# Altium schematic sheet LiPo_Charger.SchDoc: LiPo Charger
size 431 x 279 mm; Revision: 1.0; SheetNumber: 1; SheetTotal: 1
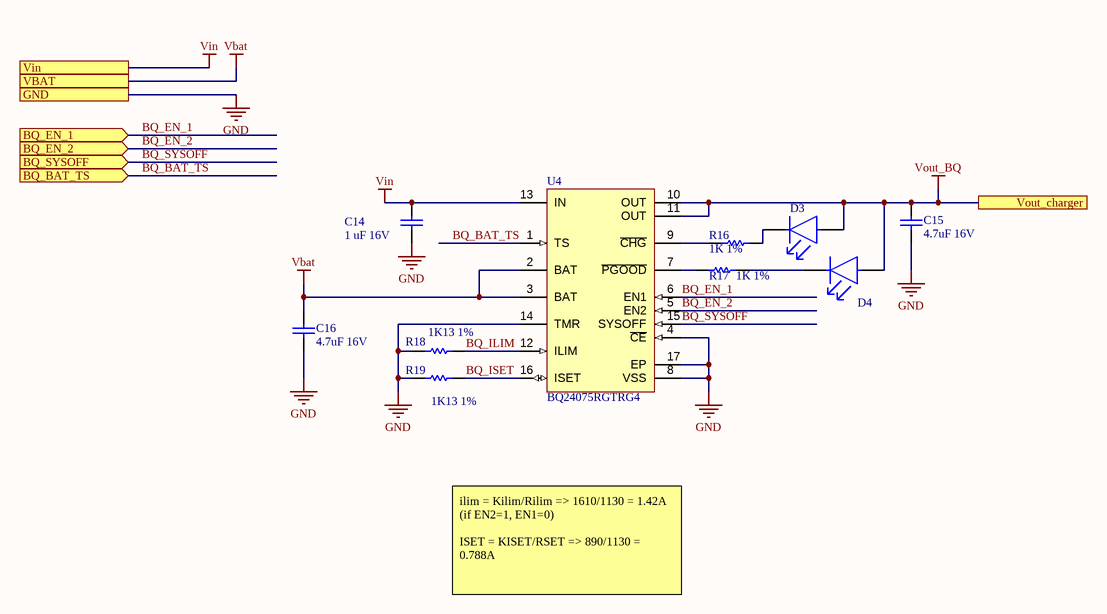
[diagram p0: LiPo_Charger.SchDoc]

## Parts
C14  1 uF 16V  [CAPC1608X90X35ML15T15]
C15  4.7uF 16V  [CAPC0805(2012)145_N]
C16  4.7uF 16V  [CAPC0805(2012)145_N]
D3  LTST-C170CKT  [FP-LTST-C170CKT-MFG]  (value not drawn)
D4  LTST-C170GKT  [FP-LTST-C170GKT-MFG]  (value not drawn)
R16  1K 1%  [RESC1609X50X30LL10T20]
R17  1K 1%  [RESC1609X50X30LL10T20]
R18  1K13 1%  [RESC0603(1608)_N]
R19  1K13 1%  [RESC0603(1608)_N]
U4  BQ24075RGTRG4  [RGT16-1700X1700TP]

## Ports
BQ_BAT_TS (in), BQ_EN_1 (in), BQ_EN_2 (in), BQ_SYSOFF (in), GND, VBAT, Vin, Vout_charger

## Nets
GND: C14.1 C15.1 C16.2 R18.1 R19.1 U4.4(~{CE}) U4.8(VSS) U4.14(TMR) U4.17(EP) ; port GND
Vbat: C16.1 U4.2(BAT) U4.3(BAT) ; port VBAT
Vin: C14.2 U4.13(IN) ; port Vin
Vout_BQ: C15.2 D3.2(A) D4.2(A) U4.10(OUT) U4.11(OUT) ; port Vout_charger
BQ_BAT_TS: U4.1(TS) ; port BQ_BAT_TS
BQ_EN_1: U4.6(EN1) ; port BQ_EN_1
BQ_EN_2: U4.5(EN2) ; port BQ_EN_2
BQ_ILIM: R18.2 U4.12(ILIM)
BQ_ISET: R19.2 U4.16(ISET)
BQ_SYSOFF: U4.15(SYSOFF) ; port BQ_SYSOFF
NetD3_1: D3.1(C) R16.2
NetD4_1: D4.1(C) R17.2
NetR16_1: R16.1 U4.9(~{CHG})
NetR17_1: R17.1 U4.7(~{PGOOD})

## Notes on the sheet
- ilim = Kilim/Rilim => 1610/1130 = 1.42A (if EN2=1, EN1=0)
  ISET = KISET/RSET => 890/1130 = 0.788A
- DWG. NO.
- REV.
- SHT.
- THIS DOCUMENT AND THE DATA DISCLOSED HEREIN OR HEREWITH IS THE PROPERTY OF ALTIUM LIMITED AND MAY BE FREELY DISTRIBUTED IN WHOLE. NO RIGHTS ARE RESERVED OR EXPRESS OR IMPLIED WARANTEE GIVEN.
- REVISION
- DESCRIPTION
- DATE
- APPROVED
- ENG:
- APPROVALS
- PROJECT
- DSN:
- CHK:
- REFERENCE DOCUMENTS
- PROJECT REVISION:
- TITLE
- DOCUMENT REVISION:
- DESIGN ITEM:
- BOM:
- FAB DWG:
- PCB DWG:
- ASSY DWG:
- SCALE:
- SIZE
- B
- CAGE CODE
- FILE NAME
- DWG NO.
- SHEET
- OF
- REV

## Library data of the parts
C14 = CMP-1035-02736-2: 0603YC105JAT2A; Manufacturer: AVX Interconnect / Elco; Part Number: 0603YC105JAT2A
C15 C16 = CMP-1036-04893-1: CAP 4.7uF 16V -20% to +80% 0805 (2012 Metric) Thickness 1.45mm SMD; Case-Metric: 2012; Case-EIA: 0805; Max Thickness: 1.45 mm; Value: 4.7uF; Rated Voltage: 16 V; Tolerance: -20% to +80%; Technology: SMT
D3 = CMP-1674-00001-6: LED RED CLEAR SMD; Dominant Wavelength: 638nm; Forward Current: 40mA; Forward Voltage: 1.8V; Lens Color: Colorless; Lens Style: Diffused; Luminous Intensity: 10mcd; Max Power Dissipation: 100mW; Number of Elements: 1; Reverse Voltage: 5V; Test Current: 10mA; Viewing Angle: 130°; Wavelength: 660nm; Package Quantity: 1; Packaging: Tape and Reel; Max Operating Temperature: 85°C; Min Operating Temperature: -55°C; Mount: Surface Mount; Length: 2mm; Height: 1.1mm; Case/Package: 0805; Case Code (Imperial): 0805; Case Code (Metric): 2012; Color: Red; Depth: 1.25mm; Illumination Color: Red; Lead Free: Lead Free; Lens Transparency: Clear; Number of LEDs: 1; Number of Pins: 2; Power Dissipation: 100mW; Power Rating: 100mW; Radiation Hardening: No; Voltage: 5V; Width: 1.25mm
D4 = CMP-1674-00002-6: LED GREEN CLEAR SMD; Dominant Wavelength: 569nm; Forward Current: 30mA; Forward Voltage: 2.1V; Lens Color: Colorless; Lens Style: Diffused; Luminous Intensity: 6mcd; Number of Elements: 1; Power Dissipation: 100mW; Reverse Voltage: 5V; Test Current: 10mA; Viewing Angle: 130°; Wavelength: 565nm; Height: 1.1mm; Package Quantity: 1; Packaging: Tape and Reel; Mount: Surface Mount; Min Operating Temperature: -55°C; Max Operating Temperature: 85°C; Length: 2mm; Case/Package: 0805; Case Code (Imperial): 0805; Case Code (Metric): 2012; Color: Green; Depth: 1.25mm; Illumination Color: Green; Lead Free: Lead Free; Lens Transparency: Clear; Number of LEDs: 1; Number of Pins: 2; Power Rating: 100mW; Radiation Hardening: No; Voltage: 5V; Width: 1.25mm
R16 R17 = CMP-1012-00510-2: CRCW06031K00FKEB; Manufacturer: Vishay Dale; Part Number: CRCW06031K00FKEB
R18 R19 = CMP-1012-00515-1: 1K13 0.1W 1% 0603 (1608 Metric)  SMD; Value: 1130.00 Ohm; Case-EIA: 0603; Case-Metric: 1608; Power: 0.1 W; Tolerance: 1 %; Technology: SMT
U4 = CMP-0321-00237-1: USB-Friendly Li-Ion Battery Charger and Power-Path Management IC, Vout 5.5 V, 4.3 V, -40 to 85 degC, 16-pin QFN (RGT), Green (RoHS & no Sb/Br); Manufacturer: Texas Instruments; Li-Ion: N; SubFamily: Battery Charge Management; Vin(Min)(V): 4.3; ComponentLink1URL: http://www.ti.com/general/docs/lit/getliterature.tsp?genericPartNumber=BQ24075&fileType=pdf; Over Voltage Protection: N; PackageDescription: 16-Pin Plastic Quad Flat No-Lead, 3 x 3 mm Body, 0.5 mm Pitch, 1.7 x 1.7 mm Exposed Pad; NiMH: N; Li-Polymer: N; Eco-Plan: Green (RoHS & no Sb/Br); Code_JEDEC: MO-220; Lead Acid: N; PartNumber: BQ24075RGTRG4; ComponentLink1Description: Datasheet; Mounting Technology: Surface Mount; PackageVersion: revH, Oct-2011; PackageReference: RGT16-1700X1700TP; NiCd: N; DatasheetVersion: SLUS810G